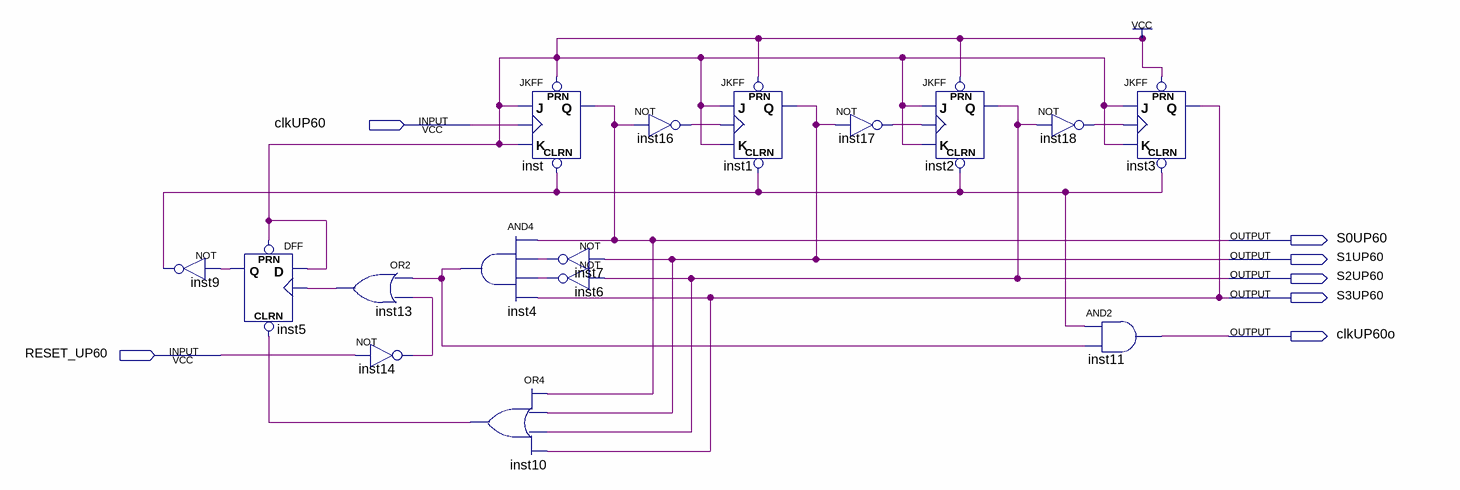
[diagram p0: schematic sheet]
// Quartus schematic contUP60.bdf as structural Verilog: 16 symbols, 7 pins
module contUP60 (
  input  clkUP60,
  input  RESET_UP60,
  output S0UP60,
  output S1UP60,
  output S2UP60,
  output S3UP60,
  output clkUP60o
);

  wire inst4_out, inst5_q, inst6_out, inst7_out, inst9_out, inst10_out, inst13_out, inst14_out, inst16_out,
       inst17_out, inst18_out;

  not inst9 (inst9_out, inst5_q);
  DFF inst5 (.CLRN(inst10_out), .CLK(inst13_out), .D(1'b1), .PRN(1'b1), .Q(inst5_q));
  or inst13 (inst13_out, inst4_out, inst14_out);
  not inst14 (inst14_out, RESET_UP60);
  and inst4 (inst4_out, S0UP60, inst7_out, inst6_out, S3UP60);
  or inst10 (inst10_out, S0UP60, S1UP60, S2UP60, S3UP60);
  JKFF inst (.PRN(1'b1), .CLRN(inst9_out), .K(1'b1), .J(1'b1), .CLK(clkUP60), .Q(S0UP60));
  not inst7 (inst7_out, S1UP60);
  not inst6 (inst6_out, S2UP60);
  not inst16 (inst16_out, S0UP60);
  JKFF inst1 (.PRN(1'b1), .CLRN(inst9_out), .K(1'b1), .J(1'b1), .CLK(inst16_out), .Q(S1UP60));
  not inst17 (inst17_out, S1UP60);
  JKFF inst2 (.PRN(1'b1), .CLRN(inst9_out), .K(1'b1), .J(1'b1), .CLK(inst17_out), .Q(S2UP60));
  not inst18 (inst18_out, S2UP60);
  and inst11 (clkUP60o, inst9_out, inst4_out);
  JKFF inst3 (.PRN(1'b1), .CLRN(inst9_out), .K(1'b1), .J(1'b1), .CLK(inst18_out), .Q(S3UP60));
endmodule
